# Altium project retroclock.PrjPcb
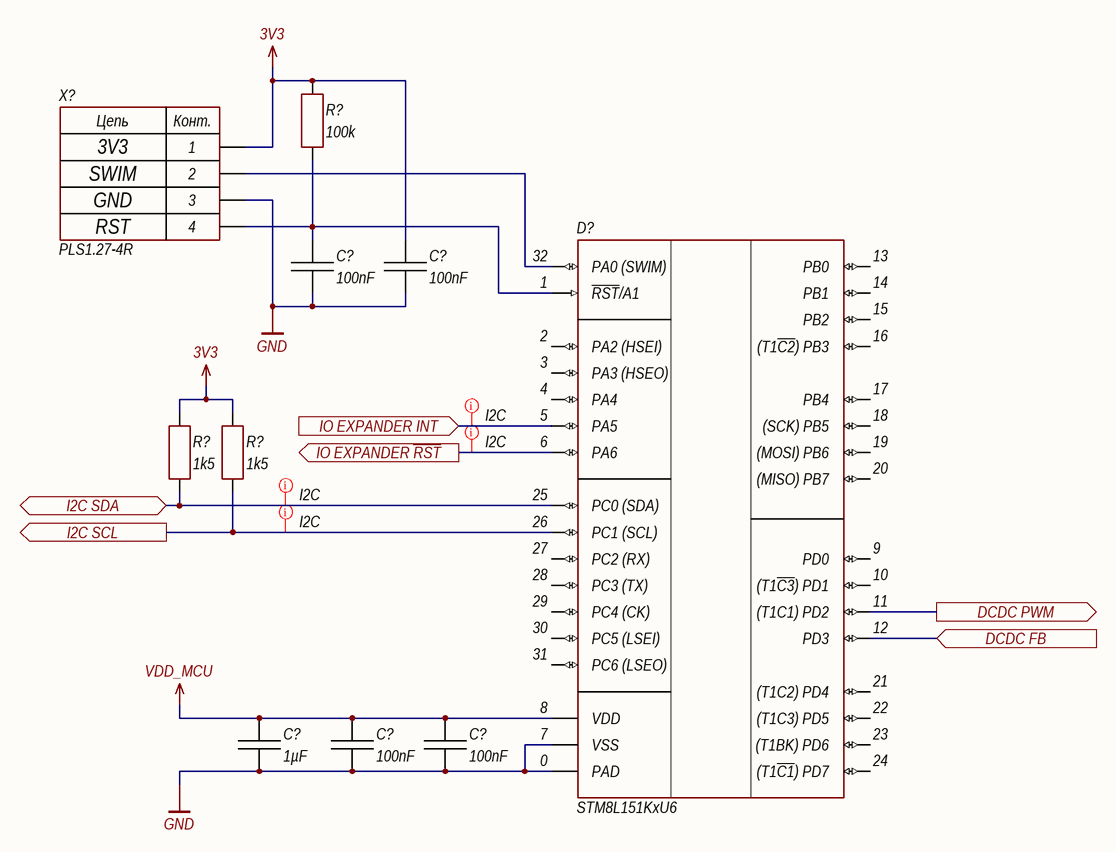
[diagram p0: MCU.SchDoc]
ProjectAuthor: Clark A.; ProjectCompanyName: Azek Clark © 2020; ProjectDate: 14.10.2020; ProjectNumber: RetroClock-SM; ProjectRevision: 001; ProjectTitle: Nixie's retro clock schematics
7 sheets, 105 parts. Net scope: flat (ports and power ports of the same name join across sheets).
Sheets:
  MCU.SchDoc
  Board-PowerSupply.SchDoc
  Board-IOExpander.SchDoc
  Nixies-segment-control.SchDoc
  Nixies-digits-control.SchDoc
  Nixies-1-2.SchDoc
  Nixies-3-4.SchDoc

## Sheet MCU.SchDoc: =ProjectTitle
size 297 x 209 mm; Author: Clark A.; CompanyName: Azek Clark © 2020; Address1: Address1; Address2: Address2; Address3: Address3; Address4: Address4; DocumentNumber: RetroClock-SM 001; SheetNumber: ?; SheetTotal: ?; Scale: 1:1; DocumentType: Схема электрическая принципиальная; FirstReferrence: RetroClock-SM; Title2str: ?

### Parts
(Parts that share a designator on the sheet are numbered #1, #2 ... from top to bottom, then left to right.)
C?#1  100nF  [CH0402C]
C?#2  100nF  [CH0402C]
C?#3  1µF  [CH0402C]
C?#4  100nF  [CH0402C]
C?#5  100nF  [CH0402C]
D?#1  STM8L151KxU6  [32-UFQFPN]
R?#1  100k  [CH0402R]
R?#2  1k5  [CH0402R]
R?#3  1k5  [CH0402R]
X?#1  PLS1.27-4R  [CON: PLS1.27-4R]

### Ports
DCDC FB (in), DCDC PWM (out), I2C SCL (out), I2C SDA (bidir), IO EXPANDER INT (in), IO EXPANDER ~{RST} (out)

### Nets
3V3: C?#2.2 R?#1.2 R?#2.2 R?#3.2 X?#1.1
GND: C?#1.1 C?#2.1 C?#3.1 C?#4.1 C?#5.1 D?#1.0(PAD) D?#1.7(VSS) X?#1.3
VDD_MCU: C?#3.2 C?#4.2 C?#5.2 D?#1.8(VDD)
DCDC FB: D?#1.12(PD3) ; port DCDC FB
DCDC PWM: D?#1.11((T1C1)_PD2) ; port DCDC PWM
I2C SCL: D?#1.26(PC1_(SCL)) R?#3.1 ; port I2C SCL
I2C SDA: D?#1.25(PC0_(SDA)) R?#2.1 ; port I2C SDA
IO EXPANDER INT: D?#1.5(PA5) ; port IO EXPANDER INT
IO EXPANDER ~{RST}: D?#1.6(PA6) ; port IO EXPANDER ~{RST}
NetC?#1_2: C?#1.2 D?#1.1(~{RST}/A1) R?#1.1 X?#1.4
NetD?#1_32: D?#1.32(PA0_(SWIM)) X?#1.2

Not connected (* = marked no-connect by the designer): D?#1 2(PA2_(HSEI)) 3(PA3_(HSEO)) 4(PA4) 9(PD0) 10((T1~{C3})_PD1) 13(PB0) 14(PB1) 15(PB2) 16((T1~{C2})_PB3) 17(PB4) 18((SCK)_PB5) 19((MOSI)_PB6) 20((MISO)_PB7) 21((T1C2)_PD4) 22((T1C3)_PD5) 23((T1BK)_PD6) 24((T1~{C1})_PD7) 27(PC2_(RX)) 28(PC3_(TX)) 29(PC4_(CK)) 30(PC5_(LSEI)) 31(PC6_(LSEO))

### Layout directives
net class I2C; rule Matched Net Lengths [Tolerance = 0.1mm]: I2C SCL, I2C SDA, IO EXPANDER INT
net class I2C: IO EXPANDER ~{RST}

### Notes on the sheet
- 3V3
- SWIM
- GND
- RST
- Утв.
- Н.контр.
- Т.контр.
- Пров.
- Разраб.
- Изм.
- Лист
- № докум.
- Подп.
- Дата
- Копировал
- Формат А4
- Лит.
- Листов
- Масса
- Масштаб
- (in symbol 4-Connector) Цепь; Конт.

### Library data of the parts
C?#1 C?#2 C?#4 C?#5 = Capacitor: Manufacturer: CCTC; Model: TCC0402X7R104K250AT; HelpURL: https://lcsc.com/product-detail/Multilayer-Ceramic-Capacitors-MLCC-SMD-SMT_CCTC-TCC0402X7R104K250AT_C466234.html; ComponentKind: X7R, 50V; Value: 100nF
C?#3 = Capacitor: Manufacturer: Samsung Electro-Mechanics; Model: CL05B105KQ5NQNC; HelpURL: https://lcsc.com/product-detail/Others_Samsung-Electro-Mechanics_CL05B105KQ5NQNC_Samsung-Electro-Mechanics-CL05B105KQ5NQNC_C307427.html; ComponentKind: X7R, 6.3V; Value: 1µF
D?#1 = STM8L151KxU6: STM8; Manufacturer: ST Microelectronics; Model: STM8L151KxU6; ComponentKind: 1.8-3.6V, UFQFPN32; HelpURL: https://ru.mouser.com/datasheet/2/389/stm8l151c4-956418.pdf
R?#1 = Resistor: Manufacturer: Uniroyal Elec; Model: 0402WGF1003TCE; HelpURL: https://lcsc.com/product-detail/Chip-Resistor-Surface-Mount_UNI-ROYAL-Uniroyal-Elec-0402WGF1003TCE_C25741.html; ComponentKind: ±1%; Value: 100k
R?#2 R?#3 = Resistor: ComponentKind: ±1%; Value: 1k5
X?#1 = 4-Connector: Model: PLS1.27-4R; Manufacturer: *; HelpURL: *; ComponentKind: *

## Sheet Board-PowerSupply.SchDoc: =ProjectTitle
size 297 x 209 mm; Author: Clark A.; CompanyName: Azek Clark © 2020; Address1: Address1; Address2: Address2; Address3: Address3; Address4: Address4; DocumentNumber: RetroClock-SM 001; SheetNumber: ?; SheetTotal: ?; Scale: 1:1; DocumentType: Схема электрическая принципиальная; FirstReferrence: RetroClock-SM
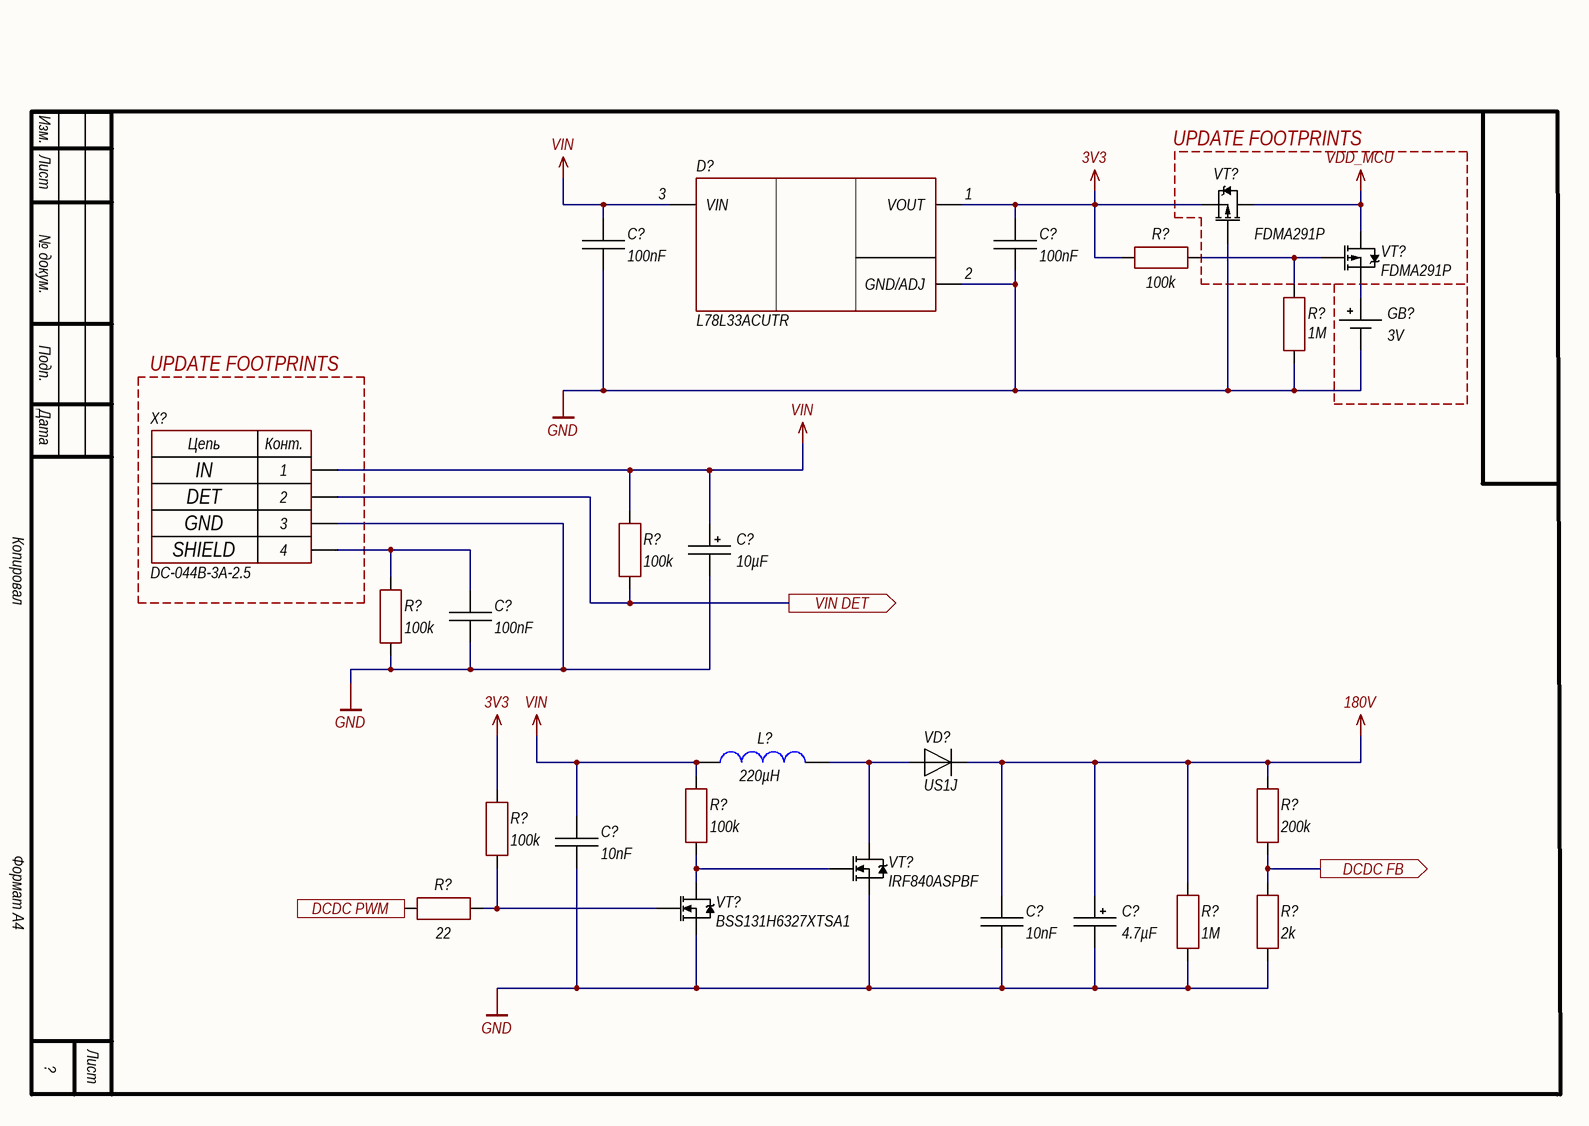
[diagram p1: Board-PowerSupply.SchDoc]

### Parts
(Parts that share a designator on the sheet are numbered #1, #2 ... from top to bottom, then left to right.)
C?#6  100nF  [CH0402C]
C?#7  100nF  [CH0402C]
C?#8  10µF  [TANTAL_A]
C?#9  100nF  [CH0402C]
C?#10  10nF  [CH1210C]
C?#11  4.7µF  [D8C3.5H12]
C?#12  10nF  [CH1210C]
D?#2  L78L33ACUTR  [SOT89_123]
GB?  3V  [BAT: 18650_single]
L?  220µH  [IND: SDR0403]
R?#4  100k  [CH0402R]
R?#5  1M  [CH0402R]
R?#6  100k  [CH0402R]
R?#7  100k  [CH0402R]
R?#8  100k  [CH0402R]
R?#9  200k  [CH0603R]
R?#10  100k  [CH0402R]
R?#11  22  [CH0402R]
R?#12  1M  [CH1206R]
R?#13  2k  [CH0603R]
VD?  US1J  [SMA]
VT?#1  FDMA291P  [8-HSOF]
VT?#2  FDMA291P  [8-HSOF]
VT?#3  IRF840ASPBF  [DPAK]
VT?#4  BSS131H6327XTSA1  [SOT23_123]
X?#2  DC-044B-3A-2.5  [CON: DC-044B-3A-2.5]

### Ports
DCDC FB (out), DCDC PWM (in), VIN DET (out)

### Nets
3V3: C?#7.2 D?#2.1(VOUT) R?#4.2 R?#10.2 VT?#1.3(S)
180V: C?#11.1 C?#12.2 R?#9.2 R?#12.2 VD?.2
GND: C?#6.1 C?#7.1 C?#8.2 C?#9.1 C?#10.1 C?#11.2 C?#12.1 D?#2.2(GND/ADJ) GB?.1 R?#5.2 R?#7.1 R?#12.1 R?#13.1 VT?#1.1(G) VT?#3.3(S) VT?#4.3(S) X?#2.3
VDD_MCU: VT?#1.2(D) VT?#2.2(D)
VIN: C?#6.2 C?#8.1 C?#10.2 D?#2.3(VIN) L?.2 R?#6.2 R?#8.2 X?#2.1
DCDC FB: R?#9.1 R?#13.2 ; port DCDC FB
DCDC PWM: R?#11.2 ; port DCDC PWM
VIN DET: R?#6.1 X?#2.2 ; port VIN DET
NetC?#9_2: C?#9.2 R?#7.2 X?#2.4
NetGB?_2: GB?.2 VT?#2.3(S)
NetL?_1: L?.1 VD?.1 VT?#3.2(D)
NetR?#4_1: R?#4.1 R?#5.1 VT?#2.1(G)
NetR?#8_1: R?#8.1 VT?#3.1(G) VT?#4.2(D)
NetR?#10_1: R?#10.1 R?#11.1 VT?#4.1(G)

### Notes on the sheet
- UPDATE FOOTPRINTS
- IN
- DET
- GND
- SHIELD
- Изм.
- Лист
- № докум.
- Подп.
- Дата
- Копировал
- Формат А4
- (in symbol 4-Connector) Цепь; Конт.

### Library data of the parts
C?#6 C?#7 C?#9 = Capacitor: as C?#1 on sheet MCU; HelpURL: https://lcsc.com/product-detail/Multilayer-Ceramic-Capacitors-MLCC-SMD-SMT_CCTC-TCC0402X7R104K250AT_C466234.html; ComponentKind: X7R, 50V; Value: 100nF
C?#8 = TantalCap: Manufacturer: *; Model: *; HelpURL: *; ComponentKind: *; Value: 10µF
C?#10 C?#12 = Capacitor: Manufacturer: AVX A Corp.; Model: 1210AC103KAT1A; HelpURL: https://www.terraelectronica.ru/product/859825; ComponentKind: X7R, 1KV; Value: 10nF
C?#11 = AlumCap: Manufacturer: *; Model: *; HelpURL: *; ComponentKind: *; Value: 4.7µF
D?#2 = L78LxxACUTR: Step-down; Manufacturer: ST Microelectronics; Model: L78L33ACUTR; HelpURL: https://www.st.com/resource/en/datasheet/l78l.pdf; ComponentKind: SOT-89, 100mA
GB? = Battery: Manufacturer: *; Model: *; HelpURL: *; ComponentKind: *; Value: 3V
L? = Inductor: Manufacturer: Bourns GmbH.; Model: SDR0403-221KL; HelpURL: https://www.terraelectronica.ru/product/992838; ComponentKind: 4.4Ohm, 220mA; Value: 220µH
R?#4 R?#6-R?#8 R?#10 R?#11 = Resistor: as R?#1 on sheet MCU; HelpURL: https://lcsc.com/product-detail/Chip-Resistor-Surface-Mount_UNI-ROYAL-Uniroyal-Elec-0402WGF1003TCE_C25741.html; ComponentKind: ±1%
  R?#4 R?#6-R?#8 R?#10: Value: 100k
  R?#11: Value: 22
R?#5 = Resistor: Manufacturer: YAGEO; Model: RC0402JR-071ML; HelpURL: https://lcsc.com/product-detail/Chip-Resistor-Surface-Mount_1MR-105-5_C93949.html; ComponentKind: ±5%; Value: 1M
R?#9 R?#12 R?#13 = Resistor: Manufacturer: *; Model: *; HelpURL: *; ComponentKind: *
  R?#9: Value: 200k
  R?#12: Value: 1M
  R?#13: Value: 2k
VD? = Diod: Manufacturer: China; ComponentKind: 600V, 1A; Model: US1J; HelpURL: https://www.chipdip.ru/product/us1j
VT?#1 VT?#2 = P-chanel: Mosfet; Manufacturer: Fairchild Semiconductor; Model: FDMA291P; ComponentKind: -1V, -20V, -6.6A, MicroFET2x2; HelpURL: https://www.chipdip.ru/product/fdma291p
VT?#3 = N-chanel: Mosfet; Manufacturer: Vishay; Model: IRF840ASPBF; ComponentKind: 500V, 2-4V, 8A; HelpURL: https://www.chipdip.ru/product/irf840as
VT?#4 = N-chanel: Mosfet; Manufacturer: Infineon Technologies Ag; Model: BSS131H6327XTSA1; ComponentKind: 240V. 1.8V, 100mA; HelpURL: https://www.terraelectronica.ru/product/1112834
X?#2 = 4-Connector: Model: DC-044B-3A-2.5; Manufacturer: *; HelpURL: *; ComponentKind: *

## Sheet Board-IOExpander.SchDoc: =ProjectTitle
size 297 x 209 mm; Author: Clark A.; CompanyName: Azek Clark © 2020; Address1: Address1; Address2: Address2; Address3: Address3; Address4: Address4; DocumentNumber: RetroClock-SM 001; SheetNumber: ?; SheetTotal: ?; Scale: 1:1; DocumentType: Схема электрическая принципиальная; FirstReferrence: RetroClock-SM
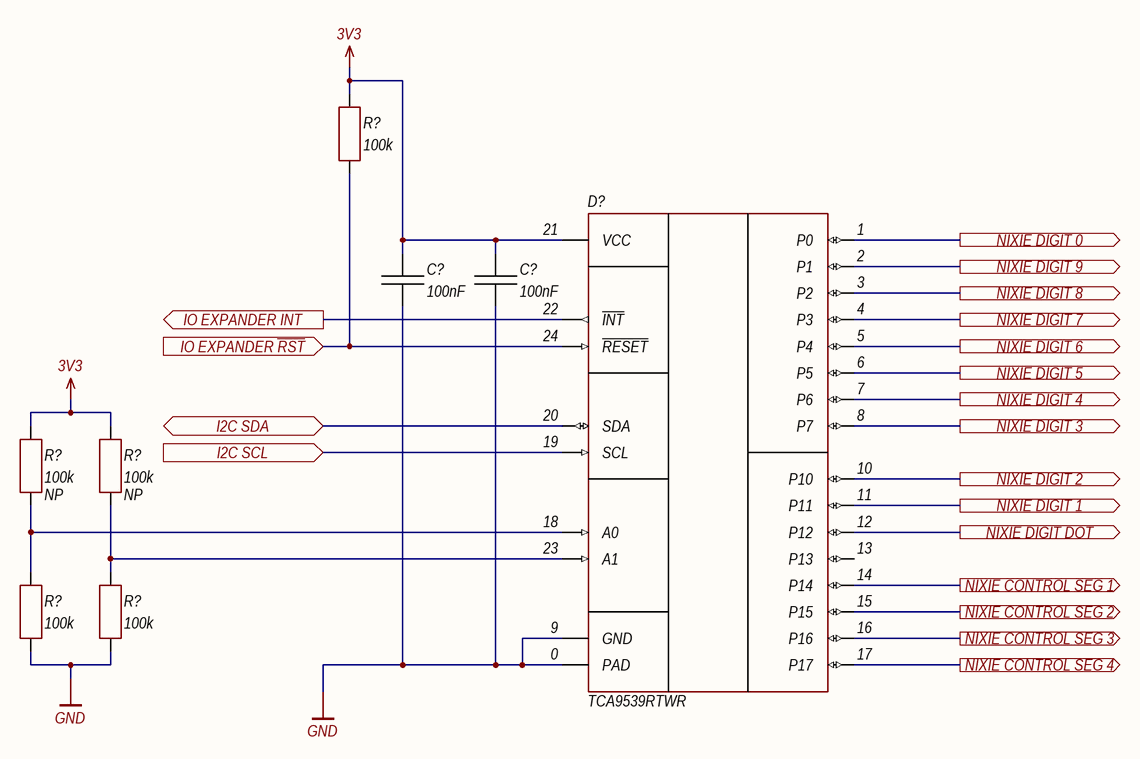
[diagram p2: Board-IOExpander.SchDoc]

### Parts
(Parts that share a designator on the sheet are numbered #1, #2 ... from top to bottom, then left to right.)
C?#13  100nF  [CH0402C]
C?#14  100nF  [CH0402C]
D?#3  TCA9539RTWR  [24-QFN (4x4)]
R?#14  100k  [CH0402R]
R?#15  100k  [CH0402R]
R?#16  100k  [CH0402R]
R?#17  100k  [CH0402R]
R?#18  100k  [CH0402R]

### Ports
I2C SCL (in), I2C SDA (bidir), IO EXPANDER INT (out), IO EXPANDER ~{RST} (in), NIXIE CONTROL SEG 1 (out), NIXIE CONTROL SEG 2 (out), NIXIE CONTROL SEG 3 (out), NIXIE CONTROL SEG 4 (out), NIXIE DIGIT 0 (out), NIXIE DIGIT 1 (out), NIXIE DIGIT 2 (out), NIXIE DIGIT 3 (out), NIXIE DIGIT 4 (out), NIXIE DIGIT 5 (out), NIXIE DIGIT 6 (out), NIXIE DIGIT 7 (out), NIXIE DIGIT 8 (out), NIXIE DIGIT 9 (out), NIXIE DIGIT DOT (out)

### Nets
3V3: C?#13.2 C?#14.2 D?#3.21(VCC) R?#14.2 R?#15.2 R?#16.2
GND: C?#13.1 C?#14.1 D?#3.0(PAD) D?#3.9(GND) R?#17.1 R?#18.1
I2C SCL: D?#3.19(SCL) ; port I2C SCL
I2C SDA: D?#3.20(SDA) ; port I2C SDA
IO EXPANDER INT: D?#3.22(~{INT}) ; port IO EXPANDER INT
IO EXPANDER ~{RST}: D?#3.24(~{RESET}) R?#14.1 ; port IO EXPANDER ~{RST}
NIXIE CONTROL SEG 1: D?#3.14(P14) ; port NIXIE CONTROL SEG 1
NIXIE CONTROL SEG 2: D?#3.15(P15) ; port NIXIE CONTROL SEG 2
NIXIE CONTROL SEG 3: D?#3.16(P16) ; port NIXIE CONTROL SEG 3
NIXIE CONTROL SEG 4: D?#3.17(P17) ; port NIXIE CONTROL SEG 4
NIXIE DIGIT 0: D?#3.1(P0) ; port NIXIE DIGIT 0
NIXIE DIGIT 1: D?#3.11(P11) ; port NIXIE DIGIT 1
NIXIE DIGIT 2: D?#3.10(P10) ; port NIXIE DIGIT 2
NIXIE DIGIT 3: D?#3.8(P7) ; port NIXIE DIGIT 3
NIXIE DIGIT 4: D?#3.7(P6) ; port NIXIE DIGIT 4
NIXIE DIGIT 5: D?#3.6(P5) ; port NIXIE DIGIT 5
NIXIE DIGIT 6: D?#3.5(P4) ; port NIXIE DIGIT 6
NIXIE DIGIT 7: D?#3.4(P3) ; port NIXIE DIGIT 7
NIXIE DIGIT 8: D?#3.3(P2) ; port NIXIE DIGIT 8
NIXIE DIGIT 9: D?#3.2(P1) ; port NIXIE DIGIT 9
NIXIE DIGIT DOT: D?#3.12(P12) ; port NIXIE DIGIT DOT
NetD?#3_18: D?#3.18(A0) R?#15.1 R?#17.2
NetD?#3_23: D?#3.23(A1) R?#16.1 R?#18.2

Not connected (* = marked no-connect by the designer): D?#3 13(P13)

### Notes on the sheet
- Изм.
- Лист
- № докум.
- Подп.
- Дата
- Копировал
- Формат А4

### Library data of the parts
C?#13 C?#14 = Capacitor: as C?#1 on sheet MCU; HelpURL: https://lcsc.com/product-detail/Multilayer-Ceramic-Capacitors-MLCC-SMD-SMT_CCTC-TCC0402X7R104K250AT_C466234.html; ComponentKind: X7R, 50V; Value: 100nF
D?#3 = TCA9539: 16-bit I2C IO expander; Manufacturer: Texas Instruments; Model: TCA9539RTWR; HelpURL: https://lcsc.com/product-detail/Interface-I-O-Expanders_Texas-Instruments_TCA9539RTWR_Texas-Instruments-Texas-Instruments-TCA9539RTWR_C134039.html; ComponentKind: 1.65-5.5V, 400kHz
R?#14-R?#18 = Resistor: as R?#1 on sheet MCU; HelpURL: https://lcsc.com/product-detail/Chip-Resistor-Surface-Mount_UNI-ROYAL-Uniroyal-Elec-0402WGF1003TCE_C25741.html; ComponentKind: ±1%; Value: 100k
  R?#15 R?#16: NP: NP

## Sheet Nixies-segment-control.SchDoc: =ProjectTitle
size 297 x 209 mm; Author: Clark A.; CompanyName: Azek Clark © 2020; Address1: Address1; Address2: Address2; Address3: Address3; Address4: Address4; DocumentNumber: RetroClock-SM 001; SheetNumber: ?; SheetTotal: ?; Scale: 1:1; DocumentType: Схема электрическая принципиальная; FirstReferrence: RetroClock-SM; Title2str: ?
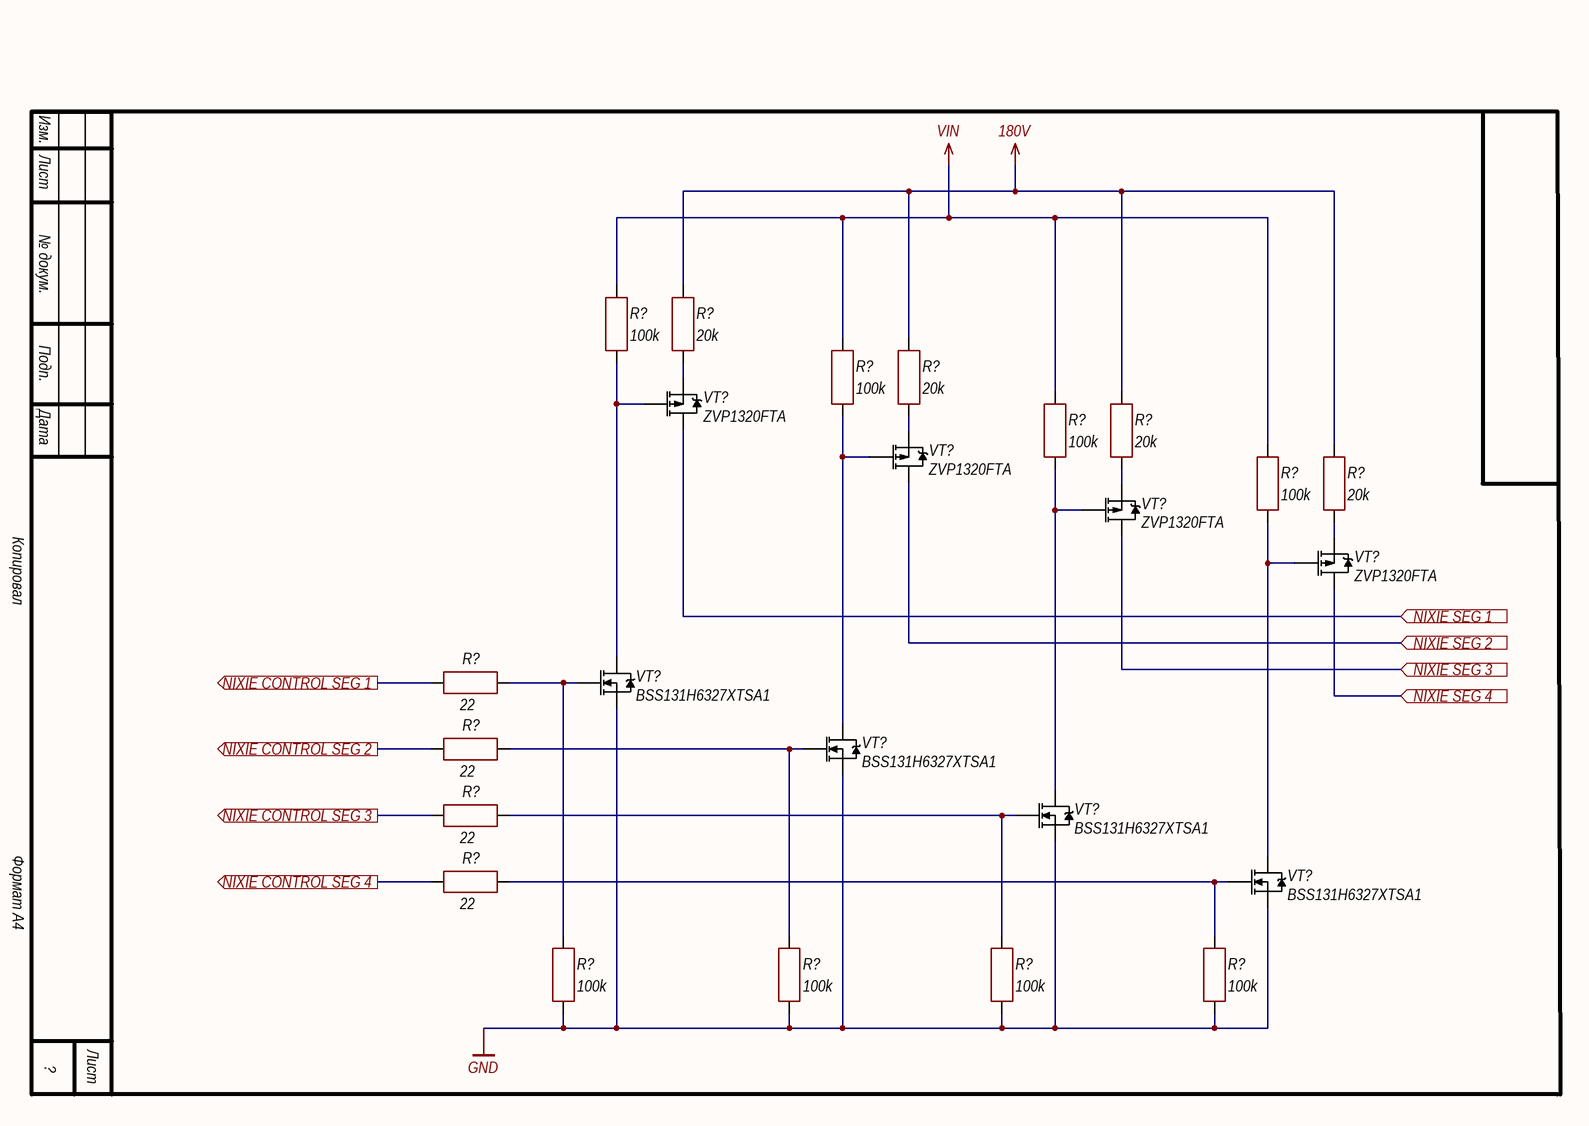
[diagram p3: Nixies-segment-control.SchDoc]

### Parts
(Parts that share a designator on the sheet are numbered #1, #2 ... from top to bottom, then left to right.)
R?#19  100k  [CH0402R]
R?#20  20k  [CH0603R]
R?#21  100k  [CH0402R]
R?#22  20k  [CH0603R]
R?#23  100k  [CH0402R]
R?#24  20k  [CH0603R]
R?#25  100k  [CH0402R]
R?#26  20k  [CH0603R]
R?#27  22  [CH0402R]
R?#28  22  [CH0402R]
R?#29  22  [CH0402R]
R?#30  22  [CH0402R]
R?#31  100k  [CH0402R]
R?#32  100k  [CH0402R]
R?#33  100k  [CH0402R]
R?#34  100k  [CH0402R]
VT?#5  ZVP1320FTA  [SOT23_123]
VT?#6  ZVP1320FTA  [SOT23_123]
VT?#7  ZVP1320FTA  [SOT23_123]
VT?#8  ZVP1320FTA  [SOT23_123]
VT?#9  BSS131H6327XTSA1  [SOT23_123]
VT?#10  BSS131H6327XTSA1  [SOT23_123]
VT?#11  BSS131H6327XTSA1  [SOT23_123]
VT?#12  BSS131H6327XTSA1  [SOT23_123]

### Ports
NIXIE CONTROL SEG 1 (out), NIXIE CONTROL SEG 2 (out), NIXIE CONTROL SEG 3 (out), NIXIE CONTROL SEG 4 (out), NIXIE SEG 1 (in), NIXIE SEG 2 (in), NIXIE SEG 3 (in), NIXIE SEG 4 (in)

### Nets
180V: R?#20.2 R?#22.2 R?#24.2 R?#26.2
GND: R?#31.1 R?#32.1 R?#33.1 R?#34.1 VT?#9.3(S) VT?#10.3(S) VT?#11.3(S) VT?#12.3(S)
VIN: R?#19.2 R?#21.2 R?#23.2 R?#25.2
NIXIE CONTROL SEG 1: R?#27.1 ; port NIXIE CONTROL SEG 1
NIXIE CONTROL SEG 2: R?#28.1 ; port NIXIE CONTROL SEG 2
NIXIE CONTROL SEG 3: R?#29.1 ; port NIXIE CONTROL SEG 3
NIXIE CONTROL SEG 4: R?#30.1 ; port NIXIE CONTROL SEG 4
NIXIE SEG 1: VT?#5.2(D) ; port NIXIE SEG 1
NIXIE SEG 2: VT?#6.2(D) ; port NIXIE SEG 2
NIXIE SEG 3: VT?#7.2(D) ; port NIXIE SEG 3
NIXIE SEG 4: VT?#8.2(D) ; port NIXIE SEG 4
NetR?#19_1: R?#19.1 VT?#5.1(G) VT?#9.2(D)
NetR?#20_1: R?#20.1 VT?#5.3(S)
NetR?#21_1: R?#21.1 VT?#6.1(G) VT?#10.2(D)
NetR?#22_1: R?#22.1 VT?#6.3(S)
NetR?#23_1: R?#23.1 VT?#7.1(G) VT?#11.2(D)
NetR?#24_1: R?#24.1 VT?#7.3(S)
NetR?#25_1: R?#25.1 VT?#8.1(G) VT?#12.2(D)
NetR?#26_1: R?#26.1 VT?#8.3(S)
NetR?#27_2: R?#27.2 R?#31.2 VT?#9.1(G)
NetR?#28_2: R?#28.2 R?#32.2 VT?#10.1(G)
NetR?#29_2: R?#29.2 R?#33.2 VT?#11.1(G)
NetR?#30_2: R?#30.2 R?#34.2 VT?#12.1(G)

### Notes on the sheet
- Изм.
- Лист
- № докум.
- Подп.
- Дата
- Копировал
- Формат А4

### Library data of the parts
R?#19-R?#34 = Resistor: Manufacturer: *; Model: *; HelpURL: *; ComponentKind: *
  R?#19 R?#21 R?#23 R?#25 R?#31-R?#34: Value: 100k
  R?#20 R?#22 R?#24 R?#26: Value: 20k
  R?#27-R?#30: Value: 22
VT?#5-VT?#8 = P-chanel: Mosfet; Manufacturer: Diodes Incorporated; Model: ZVP1320FTA; ComponentKind: -200V, -3.5V, 35mA; HelpURL: https://www.chipdip.ru/product1/8003530329
VT?#9-VT?#12 = N-chanel: as VT?#4 on sheet Board-PowerSupply; Model: BSS131H6327XTSA1; ComponentKind: 240V. 1.8V, 100mA; HelpURL: https://www.terraelectronica.ru/product/1112834

## Sheet Nixies-digits-control.SchDoc: =ProjectTitle
size 297 x 209 mm; Author: Clark A.; CompanyName: Azek Clark © 2020; Address1: Address1; Address2: Address2; Address3: Address3; Address4: Address4; DocumentNumber: RetroClock-SM 001; SheetNumber: ?; SheetTotal: ?; Scale: 1:1; DocumentType: Схема электрическая принципиальная; FirstReferrence: RetroClock-SM; Title2str: ?
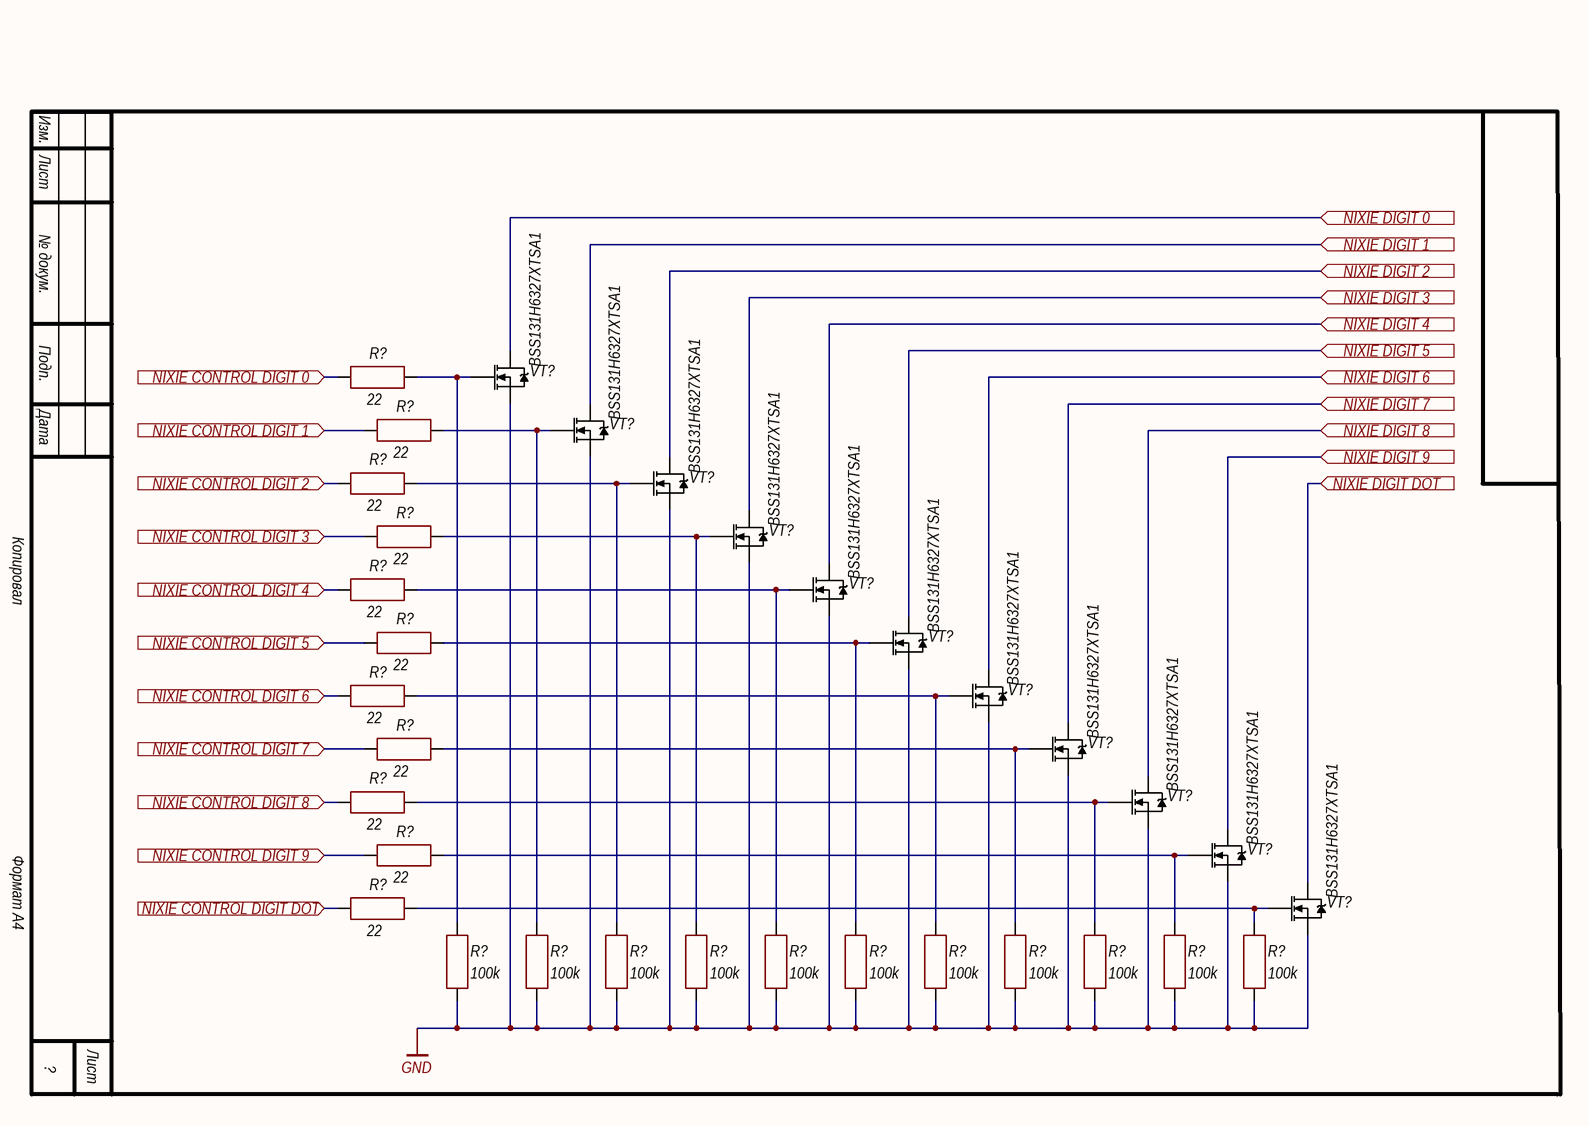
[diagram p4: Nixies-digits-control.SchDoc]

### Parts
(Parts that share a designator on the sheet are numbered #1, #2 ... from top to bottom, then left to right.)
R?#35  22  [CH0402R]
R?#36  22  [CH0402R]
R?#37  22  [CH0402R]
R?#38  22  [CH0402R]
R?#39  22  [CH0402R]
R?#40  22  [CH0402R]
R?#41  22  [CH0402R]
R?#42  22  [CH0402R]
R?#43  22  [CH0402R]
R?#44  22  [CH0402R]
R?#45  22  [CH0402R]
R?#46  100k  [CH0402R]
R?#47  100k  [CH0402R]
R?#48  100k  [CH0402R]
R?#49  100k  [CH0402R]
R?#50  100k  [CH0402R]
R?#51  100k  [CH0402R]
R?#52  100k  [CH0402R]
R?#53  100k  [CH0402R]
R?#54  100k  [CH0402R]
R?#55  100k  [CH0402R]
R?#56  100k  [CH0402R]
VT?#13  BSS131H6327XTSA1  [SOT23_123]
VT?#14  BSS131H6327XTSA1  [SOT23_123]
VT?#15  BSS131H6327XTSA1  [SOT23_123]
VT?#16  BSS131H6327XTSA1  [SOT23_123]
VT?#17  BSS131H6327XTSA1  [SOT23_123]
VT?#18  BSS131H6327XTSA1  [SOT23_123]
VT?#19  BSS131H6327XTSA1  [SOT23_123]
VT?#20  BSS131H6327XTSA1  [SOT23_123]
VT?#21  BSS131H6327XTSA1  [SOT23_123]
VT?#22  BSS131H6327XTSA1  [SOT23_123]
VT?#23  BSS131H6327XTSA1  [SOT23_123]

### Ports
NIXIE CONTROL DIGIT 0 (in), NIXIE CONTROL DIGIT 1 (in), NIXIE CONTROL DIGIT 2 (in), NIXIE CONTROL DIGIT 3 (in), NIXIE CONTROL DIGIT 4 (in), NIXIE CONTROL DIGIT 5 (in), NIXIE CONTROL DIGIT 6 (in), NIXIE CONTROL DIGIT 7 (in), NIXIE CONTROL DIGIT 8 (in), NIXIE CONTROL DIGIT 9 (in), NIXIE CONTROL DIGIT DOT (in), NIXIE DIGIT 0 (in), NIXIE DIGIT 1 (in), NIXIE DIGIT 2 (in), NIXIE DIGIT 3 (in), NIXIE DIGIT 4 (in), NIXIE DIGIT 5 (in), NIXIE DIGIT 6 (in), NIXIE DIGIT 7 (in), NIXIE DIGIT 8 (in), NIXIE DIGIT 9 (in), NIXIE DIGIT DOT (in)

### Nets
GND: R?#46.1 R?#47.1 R?#48.1 R?#49.1 R?#50.1 R?#51.1 R?#52.1 R?#53.1 R?#54.1 R?#55.1 R?#56.1 VT?#13.3(S) VT?#14.3(S) VT?#15.3(S) VT?#16.3(S) VT?#17.3(S) VT?#18.3(S) VT?#19.3(S) VT?#20.3(S) VT?#21.3(S) VT?#22.3(S) VT?#23.3(S)
NIXIE CONTROL DIGIT 0: R?#35.1 ; port NIXIE CONTROL DIGIT 0
NIXIE CONTROL DIGIT 1: R?#36.1 ; port NIXIE CONTROL DIGIT 1
NIXIE CONTROL DIGIT 2: R?#37.1 ; port NIXIE CONTROL DIGIT 2
NIXIE CONTROL DIGIT 3: R?#38.1 ; port NIXIE CONTROL DIGIT 3
NIXIE CONTROL DIGIT 4: R?#39.1 ; port NIXIE CONTROL DIGIT 4
NIXIE CONTROL DIGIT 5: R?#40.1 ; port NIXIE CONTROL DIGIT 5
NIXIE CONTROL DIGIT 6: R?#41.1 ; port NIXIE CONTROL DIGIT 6
NIXIE CONTROL DIGIT 7: R?#42.1 ; port NIXIE CONTROL DIGIT 7
NIXIE CONTROL DIGIT 8: R?#43.1 ; port NIXIE CONTROL DIGIT 8
NIXIE CONTROL DIGIT 9: R?#44.1 ; port NIXIE CONTROL DIGIT 9
NIXIE CONTROL DIGIT DOT: R?#45.1 ; port NIXIE CONTROL DIGIT DOT
NIXIE DIGIT 0: VT?#13.2(D) ; port NIXIE DIGIT 0
NIXIE DIGIT 1: VT?#14.2(D) ; port NIXIE DIGIT 1
NIXIE DIGIT 2: VT?#15.2(D) ; port NIXIE DIGIT 2
NIXIE DIGIT 3: VT?#16.2(D) ; port NIXIE DIGIT 3
NIXIE DIGIT 4: VT?#17.2(D) ; port NIXIE DIGIT 4
NIXIE DIGIT 5: VT?#18.2(D) ; port NIXIE DIGIT 5
NIXIE DIGIT 6: VT?#19.2(D) ; port NIXIE DIGIT 6
NIXIE DIGIT 7: VT?#20.2(D) ; port NIXIE DIGIT 7
NIXIE DIGIT 8: VT?#21.2(D) ; port NIXIE DIGIT 8
NIXIE DIGIT 9: VT?#22.2(D) ; port NIXIE DIGIT 9
NIXIE DIGIT DOT: VT?#23.2(D) ; port NIXIE DIGIT DOT
NetR?#35_2: R?#35.2 R?#46.2 VT?#13.1(G)
NetR?#36_2: R?#36.2 R?#47.2 VT?#14.1(G)
NetR?#37_2: R?#37.2 R?#48.2 VT?#15.1(G)
NetR?#38_2: R?#38.2 R?#49.2 VT?#16.1(G)
NetR?#39_2: R?#39.2 R?#50.2 VT?#17.1(G)
NetR?#40_2: R?#40.2 R?#51.2 VT?#18.1(G)
NetR?#41_2: R?#41.2 R?#52.2 VT?#19.1(G)
NetR?#42_2: R?#42.2 R?#53.2 VT?#20.1(G)
NetR?#43_2: R?#43.2 R?#54.2 VT?#21.1(G)
NetR?#44_2: R?#44.2 R?#55.2 VT?#22.1(G)
NetR?#45_2: R?#45.2 R?#56.2 VT?#23.1(G)

### Notes on the sheet
- Изм.
- Лист
- № докум.
- Подп.
- Дата
- Копировал
- Формат А4

### Library data of the parts
R?#35-R?#56 = Resistor: Manufacturer: *; Model: *; HelpURL: *; ComponentKind: *
  R?#35-R?#45: Value: 22
  R?#46-R?#56: Value: 100k
VT?#13-VT?#23 = N-chanel: as VT?#4 on sheet Board-PowerSupply; Model: BSS131H6327XTSA1; ComponentKind: 240V. 1.8V, 100mA; HelpURL: https://www.terraelectronica.ru/product/1112834

## Sheet Nixies-1-2.SchDoc: =ProjectTitle
size 297 x 209 mm; Author: Clark A.; CompanyName: Azek Clark © 2020; Address1: Address1; Address2: Address2; Address3: Address3; Address4: Address4; DocumentNumber: RetroClock-SM 001; SheetNumber: ?; SheetTotal: ?; Scale: 1:1; DocumentType: Схема электрическая принципиальная; FirstReferrence: RetroClock-SM; Title2str: ?
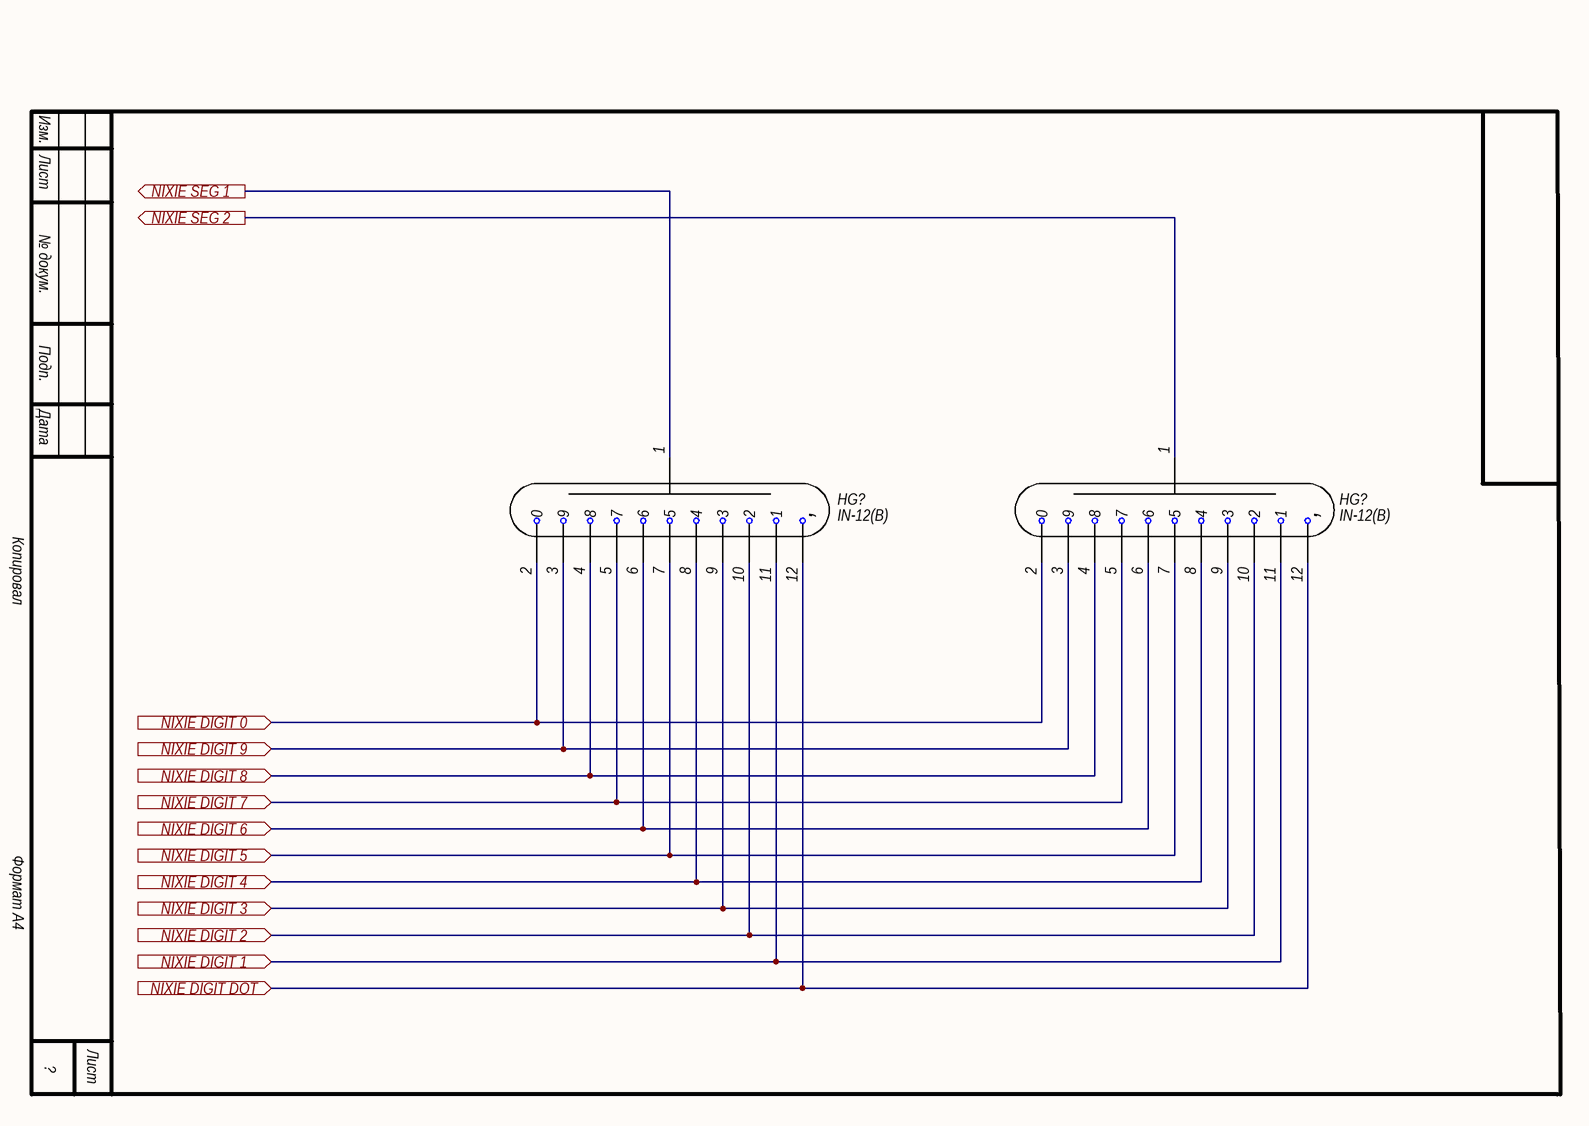
[diagram p5: Nixies-1-2.SchDoc]

### Parts
(Parts that share a designator on the sheet are numbered #1, #2 ... from top to bottom, then left to right.)
HG?#1  IN-12(B)  [IND: IN-12B]
HG?#2  IN-12(B)  [IND: IN-12B]

### Ports
NIXIE DIGIT 0 (in), NIXIE DIGIT 1 (in), NIXIE DIGIT 2 (in), NIXIE DIGIT 3 (in), NIXIE DIGIT 4 (in), NIXIE DIGIT 5 (in), NIXIE DIGIT 6 (in), NIXIE DIGIT 7 (in), NIXIE DIGIT 8 (in), NIXIE DIGIT 9 (in), NIXIE DIGIT DOT (in), NIXIE SEG 1 (out), NIXIE SEG 2 (out)

### Nets
NIXIE DIGIT 0: HG?#1.2(0) HG?#2.2(0) ; port NIXIE DIGIT 0
NIXIE DIGIT 1: HG?#1.11(1) HG?#2.11(1) ; port NIXIE DIGIT 1
NIXIE DIGIT 2: HG?#1.10(2) HG?#2.10(2) ; port NIXIE DIGIT 2
NIXIE DIGIT 3: HG?#1.9(3) HG?#2.9(3) ; port NIXIE DIGIT 3
NIXIE DIGIT 4: HG?#1.8(4) HG?#2.8(4) ; port NIXIE DIGIT 4
NIXIE DIGIT 5: HG?#1.7(5) HG?#2.7(5) ; port NIXIE DIGIT 5
NIXIE DIGIT 6: HG?#1.6 HG?#2.6 ; port NIXIE DIGIT 6
NIXIE DIGIT 7: HG?#1.5(7) HG?#2.5(7) ; port NIXIE DIGIT 7
NIXIE DIGIT 8: HG?#1.4(8) HG?#2.4(8) ; port NIXIE DIGIT 8
NIXIE DIGIT 9: HG?#1.3(9) HG?#2.3(9) ; port NIXIE DIGIT 9
NIXIE DIGIT DOT: HG?#1.12(,) HG?#2.12(,) ; port NIXIE DIGIT DOT
NIXIE SEG 1: HG?#1.1 ; port NIXIE SEG 1
NIXIE SEG 2: HG?#2.1 ; port NIXIE SEG 2

### Notes on the sheet
- Изм.
- Лист
- № докум.
- Подп.
- Дата
- Копировал
- Формат А4

### Library data of the parts
HG?#1 HG?#2 = IN-12(B): Nixie tube, digits + dot; Manufacturer: USSR; Model: IN-12(B); ComponentKind: Nixie tube; HelpURL: https://rudatasheet.ru/tubes/in-12/

## Sheet Nixies-3-4.SchDoc: =ProjectTitle
size 297 x 209 mm; Author: Clark A.; CompanyName: Azek Clark © 2020; Address1: Address1; Address2: Address2; Address3: Address3; Address4: Address4; DocumentNumber: RetroClock-SM 001; SheetNumber: ?; SheetTotal: ?; Scale: 1:1; DocumentType: Схема электрическая принципиальная; FirstReferrence: RetroClock-SM; Title2str: ?
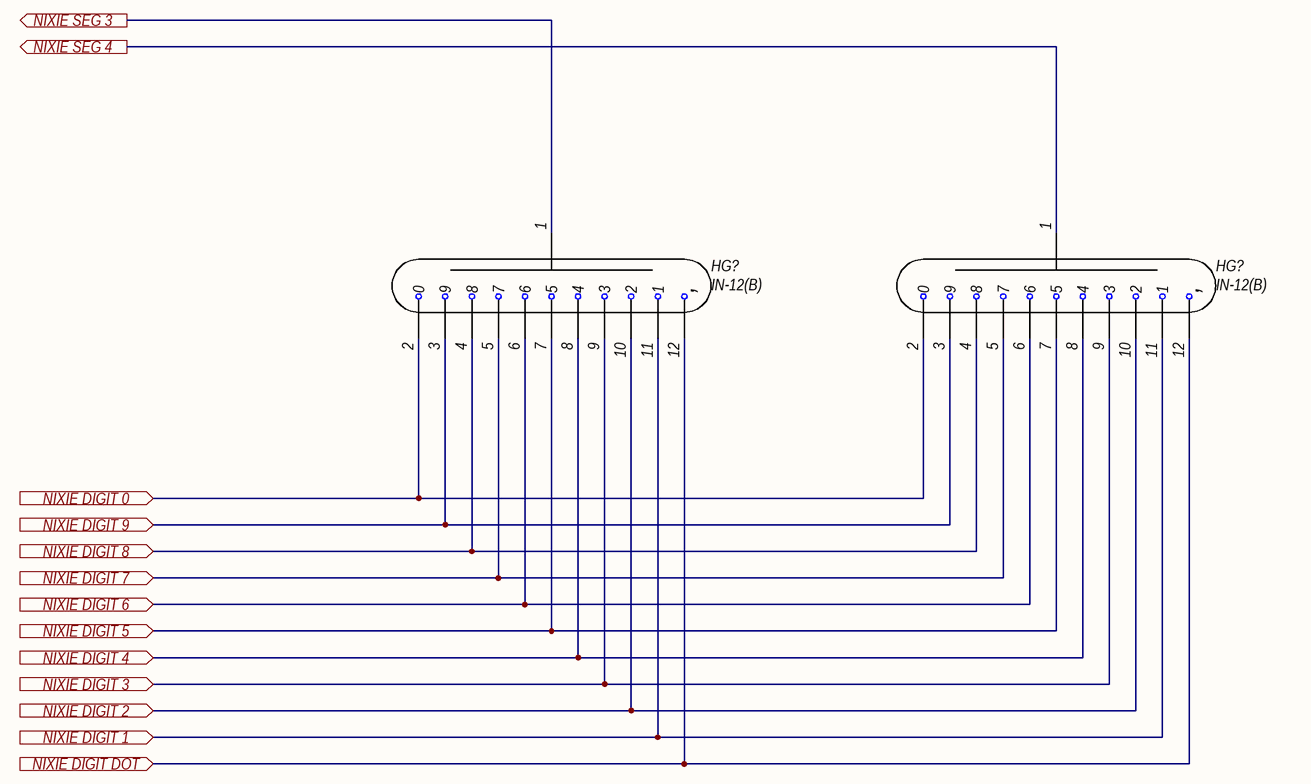
[diagram p6: Nixies-3-4.SchDoc]

### Parts
(Parts that share a designator on the sheet are numbered #1, #2 ... from top to bottom, then left to right.)
HG?#3  IN-12(B)  [IND: IN-12B]
HG?#4  IN-12(B)  [IND: IN-12B]

### Ports
NIXIE DIGIT 0 (in), NIXIE DIGIT 1 (in), NIXIE DIGIT 2 (in), NIXIE DIGIT 3 (in), NIXIE DIGIT 4 (in), NIXIE DIGIT 5 (in), NIXIE DIGIT 6 (in), NIXIE DIGIT 7 (in), NIXIE DIGIT 8 (in), NIXIE DIGIT 9 (in), NIXIE DIGIT DOT (in), NIXIE SEG 3 (out), NIXIE SEG 4 (out)

### Nets
NIXIE DIGIT 0: HG?#3.2(0) HG?#4.2(0) ; port NIXIE DIGIT 0
NIXIE DIGIT 1: HG?#3.11(1) HG?#4.11(1) ; port NIXIE DIGIT 1
NIXIE DIGIT 2: HG?#3.10(2) HG?#4.10(2) ; port NIXIE DIGIT 2
NIXIE DIGIT 3: HG?#3.9(3) HG?#4.9(3) ; port NIXIE DIGIT 3
NIXIE DIGIT 4: HG?#3.8(4) HG?#4.8(4) ; port NIXIE DIGIT 4
NIXIE DIGIT 5: HG?#3.7(5) HG?#4.7(5) ; port NIXIE DIGIT 5
NIXIE DIGIT 6: HG?#3.6 HG?#4.6 ; port NIXIE DIGIT 6
NIXIE DIGIT 7: HG?#3.5(7) HG?#4.5(7) ; port NIXIE DIGIT 7
NIXIE DIGIT 8: HG?#3.4(8) HG?#4.4(8) ; port NIXIE DIGIT 8
NIXIE DIGIT 9: HG?#3.3(9) HG?#4.3(9) ; port NIXIE DIGIT 9
NIXIE DIGIT DOT: HG?#3.12(,) HG?#4.12(,) ; port NIXIE DIGIT DOT
NIXIE SEG 3: HG?#3.1 ; port NIXIE SEG 3
NIXIE SEG 4: HG?#4.1 ; port NIXIE SEG 4

### Notes on the sheet
- Изм.
- Лист
- № докум.
- Подп.
- Дата
- Копировал
- Формат А4

### Library data of the parts
HG?#3 HG?#4 = IN-12(B): as HG?#1 on sheet Nixies-1-2; Model: IN-12(B); ComponentKind: Nixie tube; HelpURL: https://rudatasheet.ru/tubes/in-12/

## Nets that join several sheets
3V3: MCU (5 pins), Board-PowerSupply (5 pins), Board-IOExpander (6 pins)
180V: Board-PowerSupply (5 pins), Nixies-segment-control (R?#20.2 R?#22.2 R?#24.2 R?#26.2)
GND: MCU (8 pins), Board-PowerSupply (17 pins), Board-IOExpander (6 pins), Nixies-segment-control (8 pins), Nixies-digits-control (22 pins)
VDD_MCU: MCU (C?#3.2 C?#4.2 C?#5.2 D?#1.8), Board-PowerSupply (VT?#1.2 VT?#2.2)
VIN: Board-PowerSupply (8 pins), Nixies-segment-control (R?#19.2 R?#21.2 R?#23.2 R?#25.2)
DCDC FB: MCU (D?#1.12), Board-PowerSupply (R?#9.1 R?#13.2)
DCDC PWM: MCU (D?#1.11), Board-PowerSupply (R?#11.2)
I2C SCL: MCU (D?#1.26 R?#3.1), Board-IOExpander (D?#3.19)
I2C SDA: MCU (D?#1.25 R?#2.1), Board-IOExpander (D?#3.20)
IO EXPANDER INT: MCU (D?#1.5), Board-IOExpander (D?#3.22)
IO EXPANDER ~{RST}: MCU (D?#1.6), Board-IOExpander (D?#3.24 R?#14.1)
NIXIE CONTROL SEG 1: Board-IOExpander (D?#3.14), Nixies-segment-control (R?#27.1)
NIXIE CONTROL SEG 2: Board-IOExpander (D?#3.15), Nixies-segment-control (R?#28.1)
NIXIE CONTROL SEG 3: Board-IOExpander (D?#3.16), Nixies-segment-control (R?#29.1)
NIXIE CONTROL SEG 4: Board-IOExpander (D?#3.17), Nixies-segment-control (R?#30.1)
NIXIE DIGIT 0: Board-IOExpander (D?#3.1), Nixies-digits-control (VT?#13.2), Nixies-1-2 (HG?#1.2 HG?#2.2), Nixies-3-4 (HG?#3.2 HG?#4.2)
NIXIE DIGIT 1: Board-IOExpander (D?#3.11), Nixies-digits-control (VT?#14.2), Nixies-1-2 (HG?#1.11 HG?#2.11), Nixies-3-4 (HG?#3.11 HG?#4.11)
NIXIE DIGIT 2: Board-IOExpander (D?#3.10), Nixies-digits-control (VT?#15.2), Nixies-1-2 (HG?#1.10 HG?#2.10), Nixies-3-4 (HG?#3.10 HG?#4.10)
NIXIE DIGIT 3: Board-IOExpander (D?#3.8), Nixies-digits-control (VT?#16.2), Nixies-1-2 (HG?#1.9 HG?#2.9), Nixies-3-4 (HG?#3.9 HG?#4.9)
NIXIE DIGIT 4: Board-IOExpander (D?#3.7), Nixies-digits-control (VT?#17.2), Nixies-1-2 (HG?#1.8 HG?#2.8), Nixies-3-4 (HG?#3.8 HG?#4.8)
NIXIE DIGIT 5: Board-IOExpander (D?#3.6), Nixies-digits-control (VT?#18.2), Nixies-1-2 (HG?#1.7 HG?#2.7), Nixies-3-4 (HG?#3.7 HG?#4.7)
NIXIE DIGIT 6: Board-IOExpander (D?#3.5), Nixies-digits-control (VT?#19.2), Nixies-1-2 (HG?#1.6 HG?#2.6), Nixies-3-4 (HG?#3.6 HG?#4.6)
NIXIE DIGIT 7: Board-IOExpander (D?#3.4), Nixies-digits-control (VT?#20.2), Nixies-1-2 (HG?#1.5 HG?#2.5), Nixies-3-4 (HG?#3.5 HG?#4.5)
NIXIE DIGIT 8: Board-IOExpander (D?#3.3), Nixies-digits-control (VT?#21.2), Nixies-1-2 (HG?#1.4 HG?#2.4), Nixies-3-4 (HG?#3.4 HG?#4.4)
NIXIE DIGIT 9: Board-IOExpander (D?#3.2), Nixies-digits-control (VT?#22.2), Nixies-1-2 (HG?#1.3 HG?#2.3), Nixies-3-4 (HG?#3.3 HG?#4.3)
NIXIE DIGIT DOT: Board-IOExpander (D?#3.12), Nixies-digits-control (VT?#23.2), Nixies-1-2 (HG?#1.12 HG?#2.12), Nixies-3-4 (HG?#3.12 HG?#4.12)
NIXIE SEG 1: Nixies-segment-control (VT?#5.2), Nixies-1-2 (HG?#1.1)
NIXIE SEG 2: Nixies-segment-control (VT?#6.2), Nixies-1-2 (HG?#2.1)
NIXIE SEG 3: Nixies-segment-control (VT?#7.2), Nixies-3-4 (HG?#3.1)
NIXIE SEG 4: Nixies-segment-control (VT?#8.2), Nixies-3-4 (HG?#4.1)